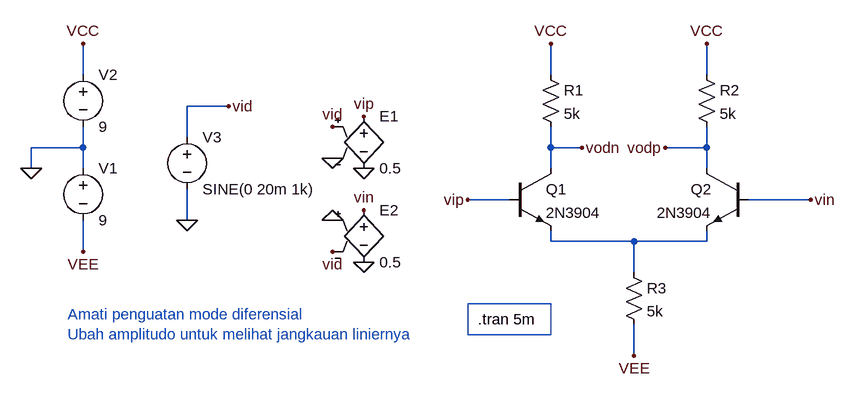
[diagram p0: schematic Perc-01-01-differentialmode.asc]
Perc-01-01-differentialmode.asc, the LTspice schematic file:
Version 4
SHEET 1 880 680
WIRE -320 -32 -320 -80
WIRE 400 -32 400 -80
WIRE 640 -32 640 -80
WIRE -96 16 -160 16
WIRE -160 64 -160 16
WIRE -320 80 -320 48
WIRE -320 80 -400 80
WIRE 400 80 400 48
WIRE 448 80 400 80
WIRE 640 80 640 48
WIRE 640 80 576 80
WIRE -400 112 -400 80
WIRE -320 112 -320 80
WIRE 400 112 400 80
WIRE 640 112 640 80
WIRE 336 160 272 160
WIRE 800 160 704 160
WIRE -160 192 -160 144
WIRE 400 224 400 208
WIRE 528 224 400 224
WIRE 640 224 640 208
WIRE 640 224 528 224
WIRE -320 240 -320 192
WIRE 528 272 528 224
WIRE 528 400 528 352
FLAG 400 -80 VCC
FLAG 640 -80 VCC
FLAG 528 400 VEE
FLAG 272 160 vip
FLAG 448 80 vodn
FLAG 576 80 vodp
FLAG -320 -80 VCC
FLAG -320 240 VEE
FLAG -400 112 0
FLAG -160 192 0
FLAG -96 16 vid
FLAG 112 112 0
FLAG 112 256 0
FLAG 64 96 0
FLAG 64 192 0
FLAG 64 240 vid
FLAG 64 48 vid
FLAG 800 160 vin
FLAG 112 176 vin
FLAG 112 32 vip
SYMBOL npn 336 112 R0
SYMATTR InstName Q1
SYMATTR Value 2N3904
SYMBOL npn 704 112 M0
SYMATTR InstName Q2
SYMATTR Value 2N3904
SYMBOL res 384 -48 R0
SYMATTR InstName R1
SYMATTR Value 5k
SYMBOL res 624 -48 R0
SYMATTR InstName R2
SYMATTR Value 5k
SYMBOL res 512 256 R0
SYMATTR InstName R3
SYMATTR Value 5k
SYMBOL voltage -320 96 R0
WINDOW 123 0 0 Left 0
WINDOW 39 0 0 Left 0
SYMATTR InstName V1
SYMATTR Value 9
SYMBOL voltage -320 -48 R0
WINDOW 123 0 0 Left 0
WINDOW 39 0 0 Left 0
SYMATTR InstName V2
SYMATTR Value 9
SYMBOL voltage -160 48 R0
WINDOW 123 0 0 Left 0
WINDOW 39 0 0 Left 0
SYMATTR InstName V3
SYMATTR Value SINE(0 20m 1k)
SYMBOL e 112 16 R0
SYMATTR InstName E1
SYMATTR Value 0.5
SYMBOL e 112 160 R0
SYMATTR InstName E2
SYMATTR Value 0.5
TEXT 288 344 Left 2 !.tran 5m
TEXT -344 336 Left 2 ;Amati penguatan mode diferensial\nUbah amplitudo untuk melihat jangkauan liniernya
RECTANGLE Normal 400 368 272 320

The netlist it stands for:
* Perc-01-01-differentialmode.asc
Q1 vodn vip N001 0 2N3904
Q2 vodp vin N001 0 2N3904
R1 VCC vodn 5k
R2 VCC vodp 5k
R3 N001 VEE 5k
V1 0 VEE 9
V2 VCC 0 9
V3 vid 0 SINE(0 20m 1k)
E1 vip 0 vid 0 0.5
E2 vin 0 0 vid 0.5
.model NPN NPN
.model PNP PNP
.lib standard.bjt
.tran 5m
* Amati penguatan mode diferensial
* Ubah amplitudo untuk melihat jangkauan liniernya
.backanno
.end